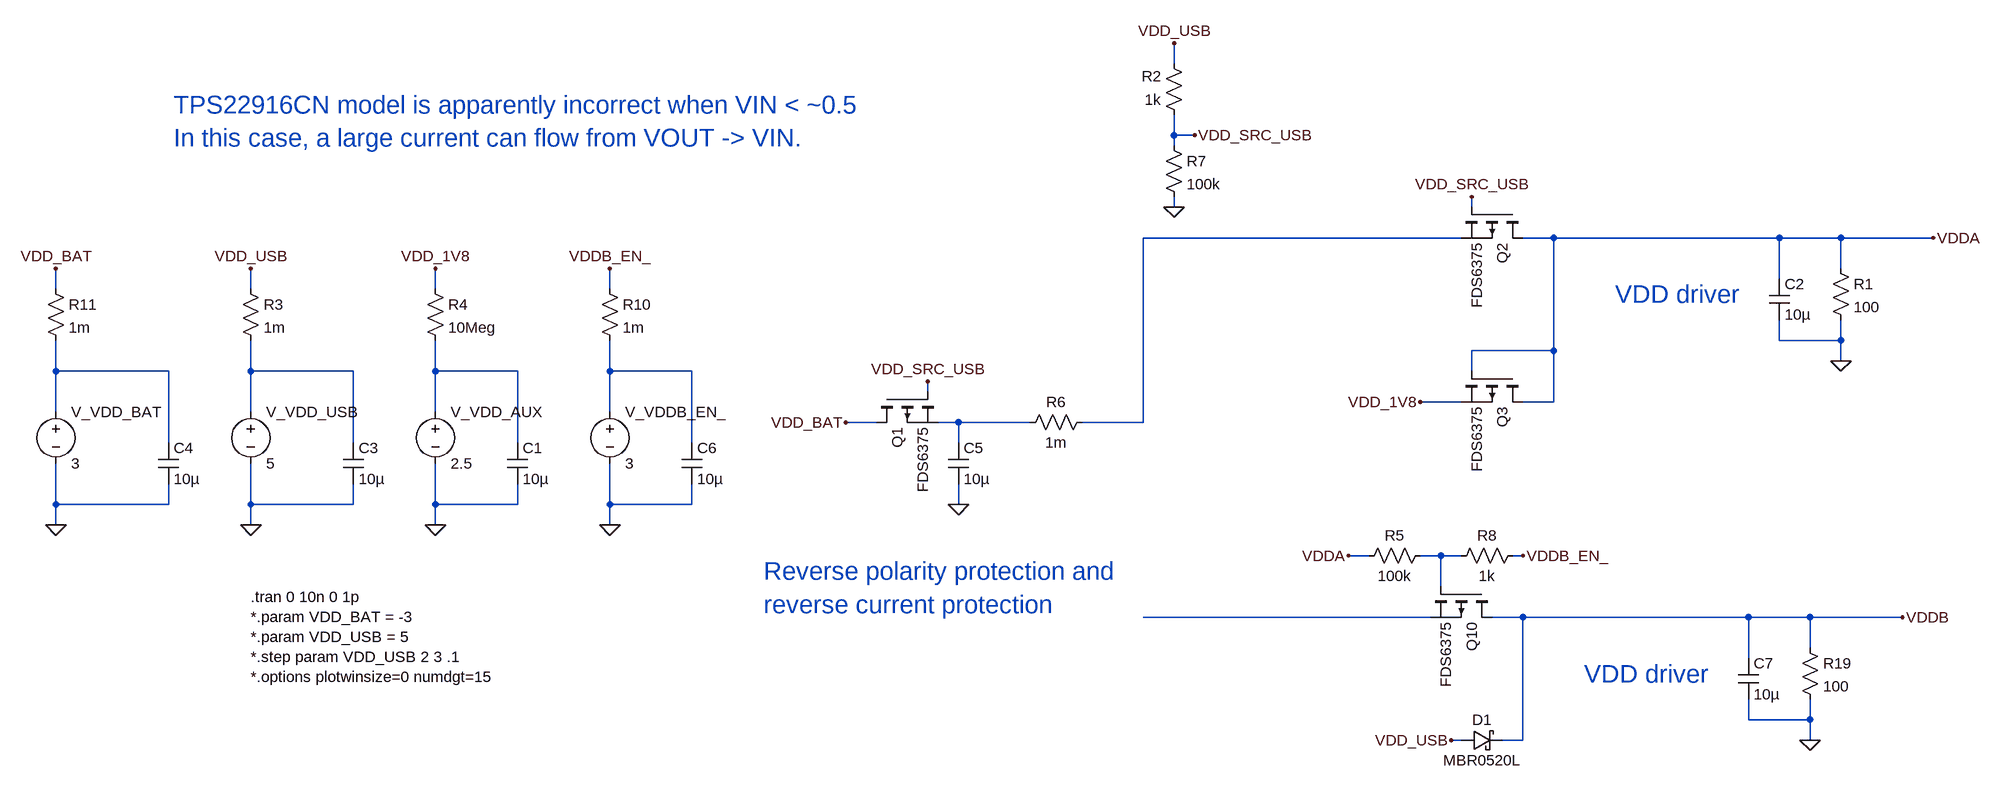
[diagram p0: schematic Schematic.asc]
Schematic.asc, the LTspice schematic file:
Version 4
SHEET 1 1688 864
WIRE -560 -1200 -560 -1232
WIRE -560 -1088 -560 -1120
WIRE -528 -1088 -560 -1088
WIRE -560 -1072 -560 -1088
WIRE -560 -976 -560 -992
WIRE -96 -976 -96 -992
WIRE -112 -928 -608 -928
WIRE 32 -928 -16 -928
WIRE 384 -928 32 -928
WIRE 480 -928 384 -928
WIRE 624 -928 480 -928
WIRE 480 -880 480 -928
WIRE 384 -864 384 -928
WIRE -2304 -848 -2304 -880
WIRE -2000 -848 -2000 -880
WIRE -1712 -848 -1712 -880
WIRE -1440 -848 -1440 -880
WIRE 384 -768 384 -800
WIRE 480 -768 480 -800
WIRE 480 -768 384 -768
WIRE 32 -752 32 -928
WIRE 32 -752 -96 -752
WIRE 480 -736 480 -768
WIRE -2304 -720 -2304 -768
WIRE -2128 -720 -2304 -720
WIRE -2000 -720 -2000 -768
WIRE -1840 -720 -2000 -720
WIRE -1712 -720 -1712 -768
WIRE -1584 -720 -1712 -720
WIRE -1440 -720 -1440 -768
WIRE -1312 -720 -1440 -720
WIRE -96 -720 -96 -752
WIRE -944 -688 -944 -704
WIRE -112 -672 -176 -672
WIRE 32 -672 32 -752
WIRE 32 -672 -16 -672
WIRE -2304 -656 -2304 -720
WIRE -2000 -656 -2000 -720
WIRE -1712 -656 -1712 -720
WIRE -1440 -656 -1440 -720
WIRE -1024 -640 -1072 -640
WIRE -896 -640 -928 -640
WIRE -784 -640 -896 -640
WIRE -608 -640 -608 -928
WIRE -608 -640 -704 -640
WIRE -2128 -608 -2128 -720
WIRE -1840 -608 -1840 -720
WIRE -1584 -608 -1584 -720
WIRE -1312 -608 -1312 -720
WIRE -896 -608 -896 -640
WIRE -2304 -512 -2304 -576
WIRE -2128 -512 -2128 -544
WIRE -2128 -512 -2304 -512
WIRE -2000 -512 -2000 -576
WIRE -1840 -512 -1840 -544
WIRE -1840 -512 -2000 -512
WIRE -1712 -512 -1712 -576
WIRE -1584 -512 -1584 -544
WIRE -1584 -512 -1712 -512
WIRE -1440 -512 -1440 -576
WIRE -1312 -512 -1312 -544
WIRE -1312 -512 -1440 -512
WIRE -896 -512 -896 -544
WIRE -2304 -480 -2304 -512
WIRE -2000 -480 -2000 -512
WIRE -1712 -480 -1712 -512
WIRE -1440 -480 -1440 -512
WIRE -256 -432 -288 -432
WIRE -144 -432 -176 -432
WIRE -112 -432 -144 -432
WIRE -16 -432 -32 -432
WIRE -144 -384 -144 -432
WIRE -160 -336 -608 -336
WIRE -16 -336 -64 -336
WIRE 336 -336 -16 -336
WIRE 432 -336 336 -336
WIRE 576 -336 432 -336
WIRE 432 -288 432 -336
WIRE 336 -272 336 -336
WIRE 336 -176 336 -208
WIRE 432 -176 432 -208
WIRE 432 -176 336 -176
WIRE -112 -144 -128 -144
WIRE -16 -144 -16 -336
WIRE -16 -144 -48 -144
WIRE 432 -144 432 -176
FLAG -2000 -480 0
FLAG -2304 -480 0
FLAG -1712 -480 0
FLAG -2000 -880 VDD_USB
FLAG -1712 -880 VDD_1V8
FLAG -1072 -640 VDD_BAT
FLAG -2304 -880 VDD_BAT
FLAG -896 -512 0
FLAG 432 -144 0
FLAG -528 -1088 VDD_SRC_USB
FLAG -944 -704 VDD_SRC_USB
FLAG 576 -336 VDDB
FLAG 480 -736 0
FLAG -96 -992 VDD_SRC_USB
FLAG 624 -928 VDDA
FLAG -1440 -480 0
FLAG -1440 -880 VDDB_EN_
FLAG -560 -1232 VDD_USB
FLAG -288 -432 VDDA
FLAG -560 -976 0
FLAG -16 -432 VDDB_EN_
FLAG -128 -144 VDD_USB
FLAG -176 -672 VDD_1V8
SYMBOL res -2016 -864 R0
SYMATTR InstName R3
SYMATTR Value 1m
SYMBOL cap -1600 -608 R0
SYMATTR InstName C1
SYMATTR Value 10µ
SYMBOL cap -1856 -608 R0
SYMATTR InstName C3
SYMATTR Value 10µ
SYMBOL cap -2144 -608 R0
SYMATTR InstName C4
SYMATTR Value 10µ
SYMBOL res -2320 -864 R0
SYMATTR InstName R11
SYMATTR Value 1m
SYMBOL voltage -2304 -672 R0
SYMATTR InstName V_VDD_BAT
SYMATTR Value 3
SYMATTR SpiceLine Cpar=1f
SYMBOL voltage -2000 -672 R0
SYMATTR InstName V_VDD_USB
SYMATTR Value 5
SYMBOL voltage -1712 -672 R0
SYMATTR InstName V_VDD_AUX
SYMATTR Value 2.5
SYMBOL res -1728 -864 R0
SYMATTR InstName R4
SYMATTR Value 10Meg
SYMBOL pmos -1024 -688 M90
SYMATTR InstName Q1
SYMATTR Value FDS6375
SYMBOL cap -912 -608 R0
SYMATTR InstName C5
SYMATTR Value 10µ
SYMBOL res 416 -304 R0
SYMATTR InstName R19
SYMATTR Value 100
SYMBOL cap 320 -272 R0
SYMATTR InstName C7
SYMATTR Value 10µ
SYMBOL pmos -64 -384 R90
SYMATTR InstName Q10
SYMATTR Value FDS6375
SYMBOL res -688 -656 R90
WINDOW 0 0 56 VBottom 2
WINDOW 3 32 56 VTop 2
SYMATTR InstName R6
SYMATTR Value 1m
SYMBOL res 464 -896 R0
SYMATTR InstName R1
SYMATTR Value 100
SYMBOL cap 368 -864 R0
SYMATTR InstName C2
SYMATTR Value 10µ
SYMBOL pmos -16 -976 R90
SYMATTR InstName Q2
SYMATTR Value FDS6375
SYMBOL res -544 -1104 R180
WINDOW 0 36 76 Left 2
WINDOW 3 36 40 Left 2
SYMATTR InstName R2
SYMATTR Value 1k
SYMBOL cap -1328 -608 R0
SYMATTR InstName C6
SYMATTR Value 10µ
SYMBOL voltage -1440 -672 R0
SYMATTR InstName V_VDDB_EN_
SYMATTR Value 3
SYMBOL res -1456 -864 R0
SYMATTR InstName R10
SYMATTR Value 1m
SYMBOL res -160 -448 R90
WINDOW 0 0 56 VBottom 2
WINDOW 3 32 56 VTop 2
SYMATTR InstName R5
SYMATTR Value 100k
SYMBOL res -576 -1088 R0
SYMATTR InstName R7
SYMATTR Value 100k
SYMBOL res -128 -416 R270
WINDOW 0 32 56 VTop 2
WINDOW 3 0 56 VBottom 2
SYMATTR InstName R8
SYMATTR Value 1k
SYMBOL schottky -112 -128 R270
WINDOW 0 32 32 VTop 2
WINDOW 3 0 32 VBottom 2
SYMATTR InstName D1
SYMATTR Value MBR0520L
SYMATTR Description Diode
SYMATTR Type diode
SYMBOL pmos -16 -720 R90
SYMATTR InstName Q3
SYMATTR Value FDS6375
TEXT -2000 -368 Left 2 !.tran 0 10n 0 1p\n*.param VDD_BAT = -3\n*.param VDD_USB = 5\n*.step param VDD_USB 2 3 .1\n*.options plotwinsize=0 numdgt=15
TEXT -1200 -408 Left 4 ;Reverse polarity protection and\nreverse current protection
TEXT 80 -248 Left 4 ;VDD driver
TEXT 128 -840 Left 4 ;VDD driver
TEXT -2120 -1136 Left 4 ;TPS22916CN model is apparently incorrect when VIN < ~0.5\nIn this case, a large current can flow from VOUT -> VIN.

The netlist it stands for:
* Schematic.asc
R3 VDD_USB N003 1m
C1 N004 0 10µ
C3 N003 0 10µ
C4 N002 0 10µ
R11 VDD_BAT N002 1m
V_VDD_BAT N002 0 3 Cpar=1f
V_VDD_USB N003 0 5
V_VDD_AUX N004 0 2.5
R4 VDD_1V8 N004 10Meg
M§Q1 VDD_BAT VDD_SRC_USB N006 N006 FDS6375
C5 N006 0 10µ
R19 VDDB 0 100
C7 VDDB 0 10µ
M§Q10 VDDB N007 N008 N008 FDS6375
R6 N001 N006 1m
R1 VDDA 0 100
C2 VDDA 0 10µ
M§Q2 VDDA VDD_SRC_USB N001 N001 FDS6375
R2 VDD_SRC_USB VDD_USB 1k
C6 N005 0 10µ
V_VDDB_EN_ N005 0 3
R10 VDDB_EN_ N005 1m
R5 N007 VDDA 100k
R7 VDD_SRC_USB 0 100k
R8 N007 VDDB_EN_ 1k
D1 VDD_USB VDDB MBR0520L
M§Q3 VDDA VDDA VDD_1V8 VDD_1V8 FDS6375
.model D D
.lib standard.dio
.model NMOS NMOS
.model PMOS PMOS
.lib standard.mos
.tran 0 10n 0 1p
*.param VDD_BAT = -3
*.param VDD_USB = 5
*.step param VDD_USB 2 3 .1
*.options plotwinsize=0 numdgt=15
* Reverse polarity protection and
* reverse current protection
* VDD driver
* VDD driver
* TPS22916CN model is apparently incorrect when VIN < ~0.5
* In this case, a large current can flow from VOUT -> VIN.
.backanno
.end